# EAGLE design sapflow_pcb_v1 (EAGLE 9.1.3)
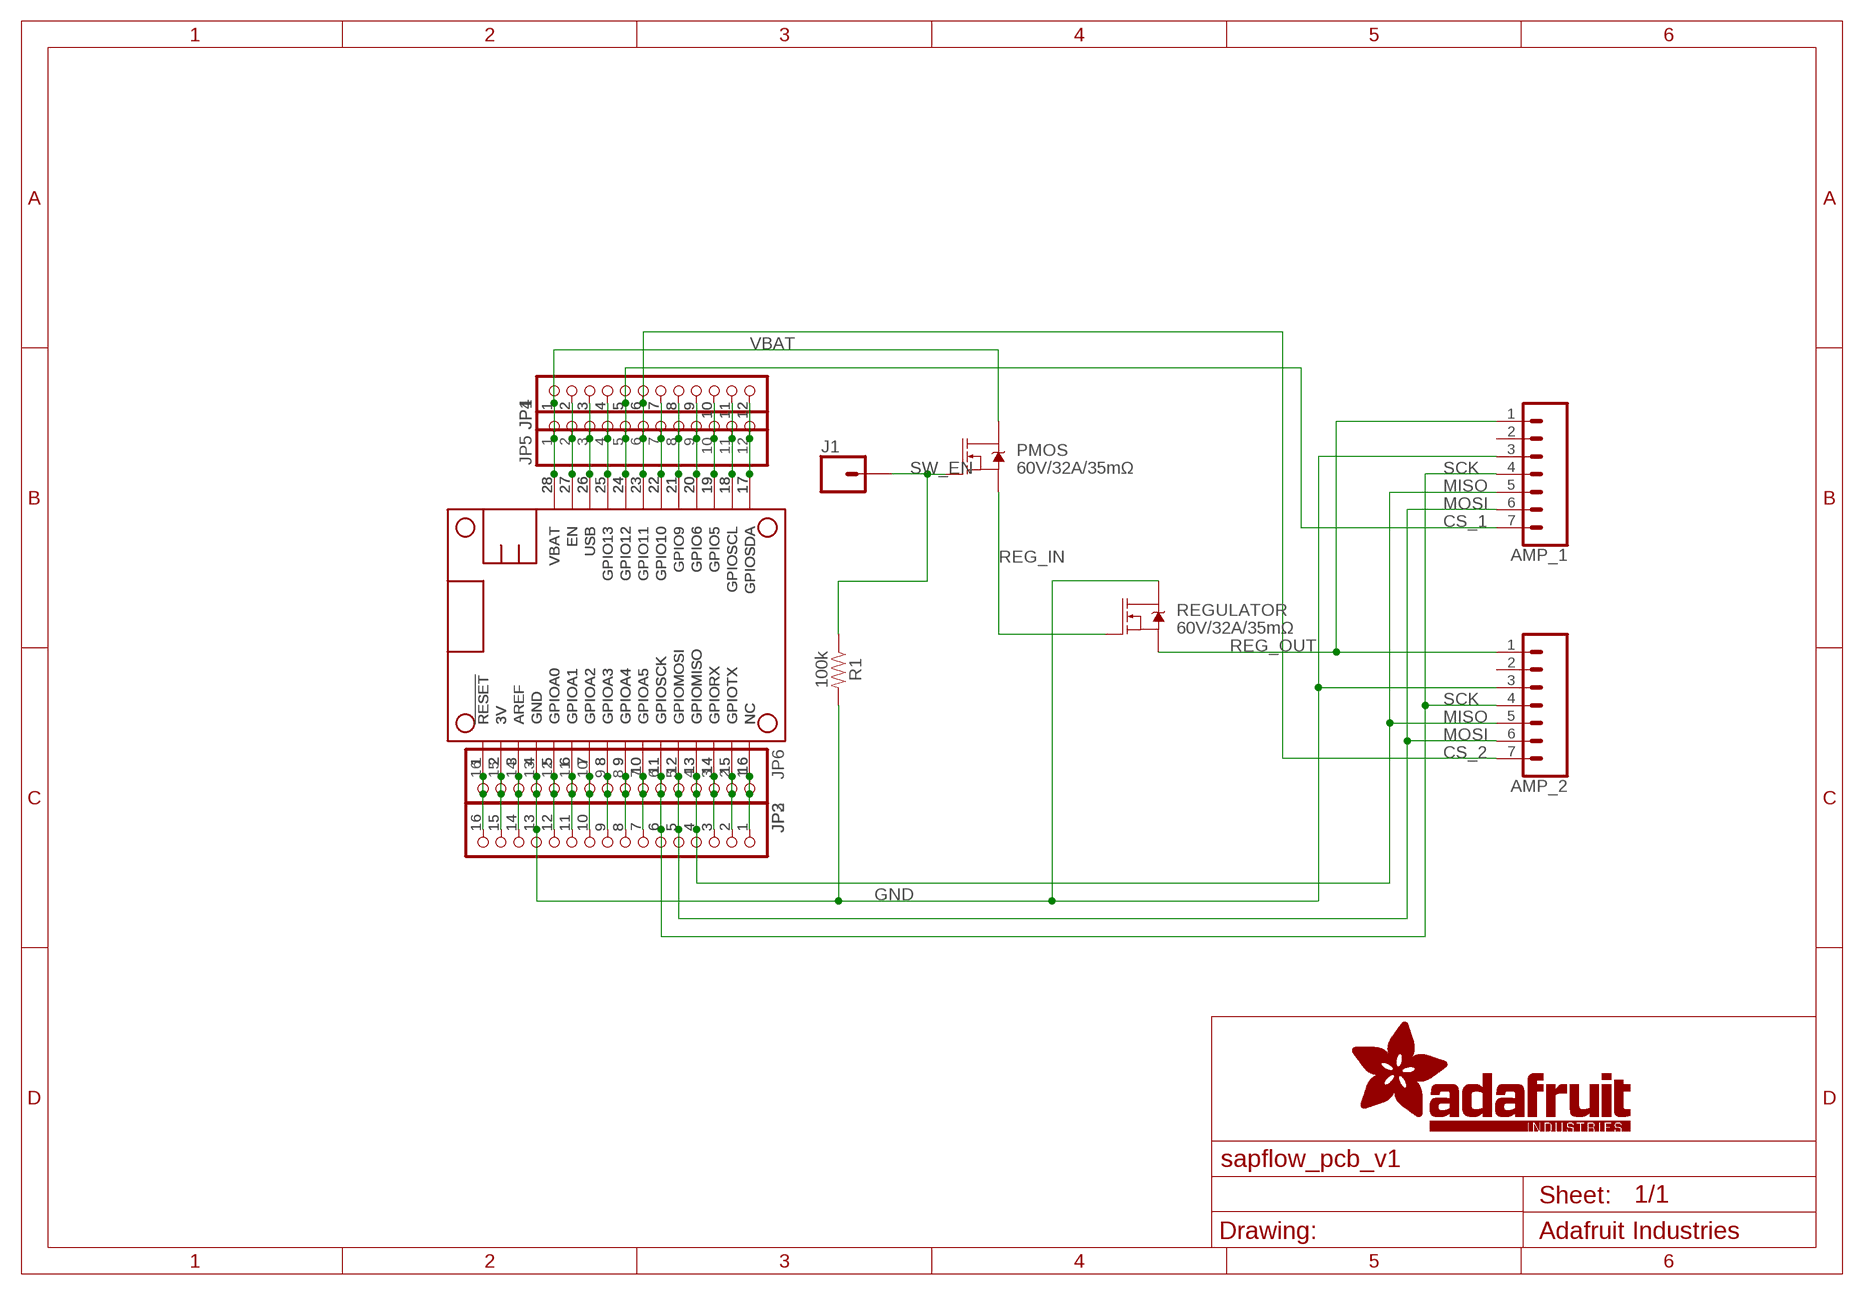
[diagram p0: schematic, sheet 1]

## Parts
AMP_1  CONN_07  [1X07]
AMP_2  CONN_07  [1X07]
J1  CONN_01  [1X01]
JP1  HEADER-1X1276MIL  [1X12_ROUND_76MIL]
JP2  HEADER-1X16_76MIL  [1X16_ROUND_76MIL]
JP3  HEADER-1X16_76MIL  [1X16_ROUND_76MIL]
JP4  HEADER-1X1276MIL  [1X12_ROUND_76MIL]
JP5  HEADER-1X1276MIL  [1X12_ROUND_76MIL]
JP6  HEADER-1X16_76MIL  [1X16_ROUND_76MIL]
MS1  FEATHERWING_NODIM  [FEATHERWING_DIM]
MS2  FEATHERWING_NODIM  [FEATHERWING_DIM]
MS3  FEATHERWING_NODIM  [FEATHERWING_DIM]
PMOS  60V/32A/35mΩ  MOSFET-NCH-FQP30N06L  [TO220V]
R1  100k  100KOHM-HORIZ-1/4W-1%  [AXIAL-0.3]
REGULATOR  60V/32A/35mΩ  MOSFET-NCH-FQP30N06L  [TO220V]

## Nets
3V: JP2.15 JP3.15 JP6.15 MS1.2(3V) MS2.2(3V) MS3.2(3V)
A: JP2.12 JP3.12 JP6.12 MS1.5(GPIOA0) MS2.5(GPIOA0) MS3.5(GPIOA0)
AREF: JP2.14 JP3.14 JP6.14 MS1.3(AREF) MS2.3(AREF) MS3.3(AREF)
B: JP2.11 JP3.11 JP6.11 MS1.6(GPIOA1) MS2.6(GPIOA1) MS3.6(GPIOA1)
C: JP2.10 JP3.10 JP6.10 MS1.7(GPIOA2) MS2.7(GPIOA2) MS3.7(GPIOA2)
CS_1: AMP_1.7 JP1.5 JP4.5 JP5.5 MS1.24(GPIO12) MS2.24(GPIO12) MS3.24(GPIO12)
CS_2: AMP_2.7 JP1.6 JP4.6 JP5.6 MS1.23(GPIO11) MS2.23(GPIO11) MS3.23(GPIO11)
D: JP2.9 JP3.9 JP6.9 MS1.8(GPIOA3) MS2.8(GPIOA3) MS3.8(GPIOA3)
E: JP2.8 JP3.8 JP6.8 MS1.9(GPIOA4) MS2.9(GPIOA4) MS3.9(GPIOA4)
EN: JP1.2 JP4.2 JP5.2 MS1.27(EN) MS2.27(EN) MS3.27(EN)
F: JP2.7 JP3.7 JP6.7 MS1.10(GPIOA5) MS2.10(GPIOA5) MS3.10(GPIOA5)
G: JP2.1 JP3.1 JP6.1 MS1.16(NC) MS2.16(NC) MS3.16(NC)
GND: AMP_1.3 AMP_2.3 JP2.13 JP3.13 JP6.13 MS1.4(GND) MS2.4(GND) MS3.4(GND) R1.P$2 REGULATOR.2(D)
I: JP1.9 JP4.9 JP5.9 MS1.20(GPIO6) MS2.20(GPIO6) MS3.20(GPIO6)
J: JP1.10 JP4.10 JP5.10 MS1.19(GPIO5) MS2.19(GPIO5) MS3.19(GPIO5)
K: JP1.8 JP4.8 JP5.8 MS1.21(GPIO9) MS2.21(GPIO9) MS3.21(GPIO9)
L: JP1.7 JP4.7 JP5.7 MS1.22(GPIO10) MS2.22(GPIO10) MS3.22(GPIO10)
MISO: AMP_1.5 AMP_2.5 JP2.4 JP3.4 JP6.4 MS1.13(GPIOMISO) MS2.13(GPIOMISO) MS3.13(GPIOMISO)
MOSI: AMP_1.6 AMP_2.6 JP2.5 JP3.5 JP6.5 MS1.12(GPIOMOSI) MS2.12(GPIOMOSI) MS3.12(GPIOMOSI)
O: JP1.4 JP4.4 JP5.4 MS1.25(GPIO13) MS2.25(GPIO13) MS3.25(GPIO13)
REG_IN: PMOS.3(S) REGULATOR.1(G)
REG_OUT: AMP_1.1 AMP_2.1 REGULATOR.3(S)
RESET: JP2.16 JP3.16 JP6.16 MS1.1(!RESET) MS2.1(!RESET) MS3.1(!RESET)
RX: JP2.3 JP3.3 JP6.3 MS1.14(GPIORX) MS2.14(GPIORX) MS3.14(GPIORX)
SCK: AMP_1.4 AMP_2.4 JP2.6 JP3.6 JP6.6 MS1.11(GPIOSCK) MS2.11(GPIOSCK) MS3.11(GPIOSCK)
SCL: JP1.11 JP4.11 JP5.11 MS1.18(GPIOSCL) MS2.18(GPIOSCL) MS3.18(GPIOSCL)
SDA: JP1.12 JP4.12 JP5.12 MS1.17(GPIOSDA) MS2.17(GPIOSDA) MS3.17(GPIOSDA)
SW_EN: J1.1 PMOS.1(G) R1.P$1
TX: JP2.2 JP3.2 JP6.2 MS1.15(GPIOTX) MS2.15(GPIOTX) MS3.15(GPIOTX)
USB: JP1.3 JP4.3 JP5.3 MS1.26(USB) MS2.26(USB) MS3.26(USB)
VBAT: JP1.1 JP4.1 JP5.1 MS1.28(VBAT) MS2.28(VBAT) MS3.28(VBAT) PMOS.2(D)
Unconnected: AMP_1.2 AMP_2.2

## Library data of the parts
AMP_1 AMP_2 = SparkFun-Connectors:CONN_07: Multi connection point. Often used as Generic Header-pin footprint for 0.1 inch spaced/style header connections On any of the 0.1 inch spaced packages, you can populate with these: Break Away Headers - Straight <https://www.sparkfun.com/products/116> (PRT-00116) Break Away Male Headers - Right Angle <https://www.sparkfun.com/products/553> (PRT-00553) Female Headers <https://www.sparkfun.com/products/115> (PRT-00115) Break Away Headers - Machine Pin <https://www.sparkfun.com/products/117> (PRT-00117) Break Away Female Headers - Swiss Machine Pin <https://www.sparkfun.com/products/743> (PRT-00743) For SCREWTERMINALS and SPRING TERMINALS visit here: Screw Terimnals on SparkFun.com <https://www.sparkfun.com/search/results?term=Screw+Terminals> (5mm/3.5mm/2.54mm spacing) This device is also useful as a general connection point to wire up your design to another part of your project. Our various solder wires solder well into these plated through hole pads. Hook-Up Wire - Assortment (Stranded, 22 AWG) <https://www.sparkfun.com/products/11375> (PRT-11375) Hook-Up Wire - Assortment (Solid Core, 22 AWG) <https://www.sparkfun.com/products/11367> (PRT-11367) View the entire wire category on our website here <https://www.sparkfun.com/categories/141> Special notes: Molex polarized connector foot print use with SKU : PRT-08231 with associated crimp pins and housings. 1MM SMD Version SKU: PRT-10208 NOTES ON THE VARIANTS LOCK and LOCK_LONGPADS... This footprint was designed to help hold the alignment of a through-hole component (i.e. 6-pin header) while soldering it into place. You may notice that each hole has been shifted either up or down by 0.005 of an inch from it's more standard position (which is a perfectly straight line). This slight alteration caused the pins (the squares in the middle) to touch the edges of the holes. Because they are alternating, it causes a "brace" to hold the component in place. 0.005 has proven to be the perfect amount of "off-center" position when using our standard breakaway headers. Although looks a little odd when you look at the bare footprint, once you have a header in there, the alteration is very hard to notice. Also,if you push a header all the way into place, it is covered up entirely on the bottom side.
J1 = SparkFun-Connectors:CONN_01: Single connection point. Often used as Generic Header-pin footprint for 0.1 inch spaced/style header connections On any of the 0.1 inch spaced packages, you can populate with these: Break Away Headers - Straight <https://www.sparkfun.com/products/116> (PRT-00116) Break Away Male Headers - Right Angle <https://www.sparkfun.com/products/553> (PRT-00553) Female Headers <https://www.sparkfun.com/products/115> (PRT-00115) Break Away Headers - Machine Pin <https://www.sparkfun.com/products/117> (PRT-00117) Break Away Female Headers - Swiss Machine Pin <https://www.sparkfun.com/products/743> (PRT-00743) This device is also useful as a general connection point to wire up your design to another part of your project. Our various solder wires solder well into these plated through hole pads. Hook-Up Wire - Assortment (Stranded, 22 AWG) <https://www.sparkfun.com/products/11375> (PRT-11375) Hook-Up Wire - Assortment (Solid Core, 22 AWG) <https://www.sparkfun.com/products/11367> (PRT-11367) View the entire wire category on our website here <https://www.sparkfun.com/categories/141> Special notes: SMTSO-256-ET is a "flush mount" nut for a 4-40 screw. We mostly use this on specialty testbeds; it is a nice way to connect hardware to your PCB at an adjustable hieght. Also note, the SNAP packages are for using a snappable style connector. We sell a baggie of snaps and they are also used on two LilyPad designs: Snap Assortment - 30 pack (male and female) <https://www.sparkfun.com/products/11347> (DEV-11347) LilyPad Arduino SimpleSnap <https://www.sparkfun.com/products/10941> (DEV-10941) LilyPad SimpleSnap Protoboard <https://www.sparkfun.com/products/10940> (DEV-10940)
JP1 JP4 JP5 = microbuilder:HEADER-1X12
JP2 JP3 JP6 = microbuilder:HEADER-1X16: PIN HEADER
MS1-MS3 = microbuilder:FEATHERWING
PMOS REGULATOR = SparkFun-DiscreteSemi:MOSFET-NCH: N-channel MOSFETs Voltage controlled devices that allow control of high current outputs. SparkFun Products: SparkFun OpenScale <https://www.sparkfun.com/products/13261> SparkFun Digital Sandbox <https://www.sparkfun.com/products/12651> SparkFun Monster Moto Shield <https://www.sparkfun.com/products/10182> SparkFun MOSFET Power Controller <https://www.sparkfun.com/products/11214>; PROD_ID: TRANS-10060
R1 = SparkFun-Resistors:100KOHM: 100kΩ resistor A resistor is a passive two-terminal electrical component that implements electrical resistance as a circuit element. Resistors act to reduce current flow, and, at the same time, act to lower voltage levels within circuits. - Wikipedia; PROD_ID: RES-12184

## Board
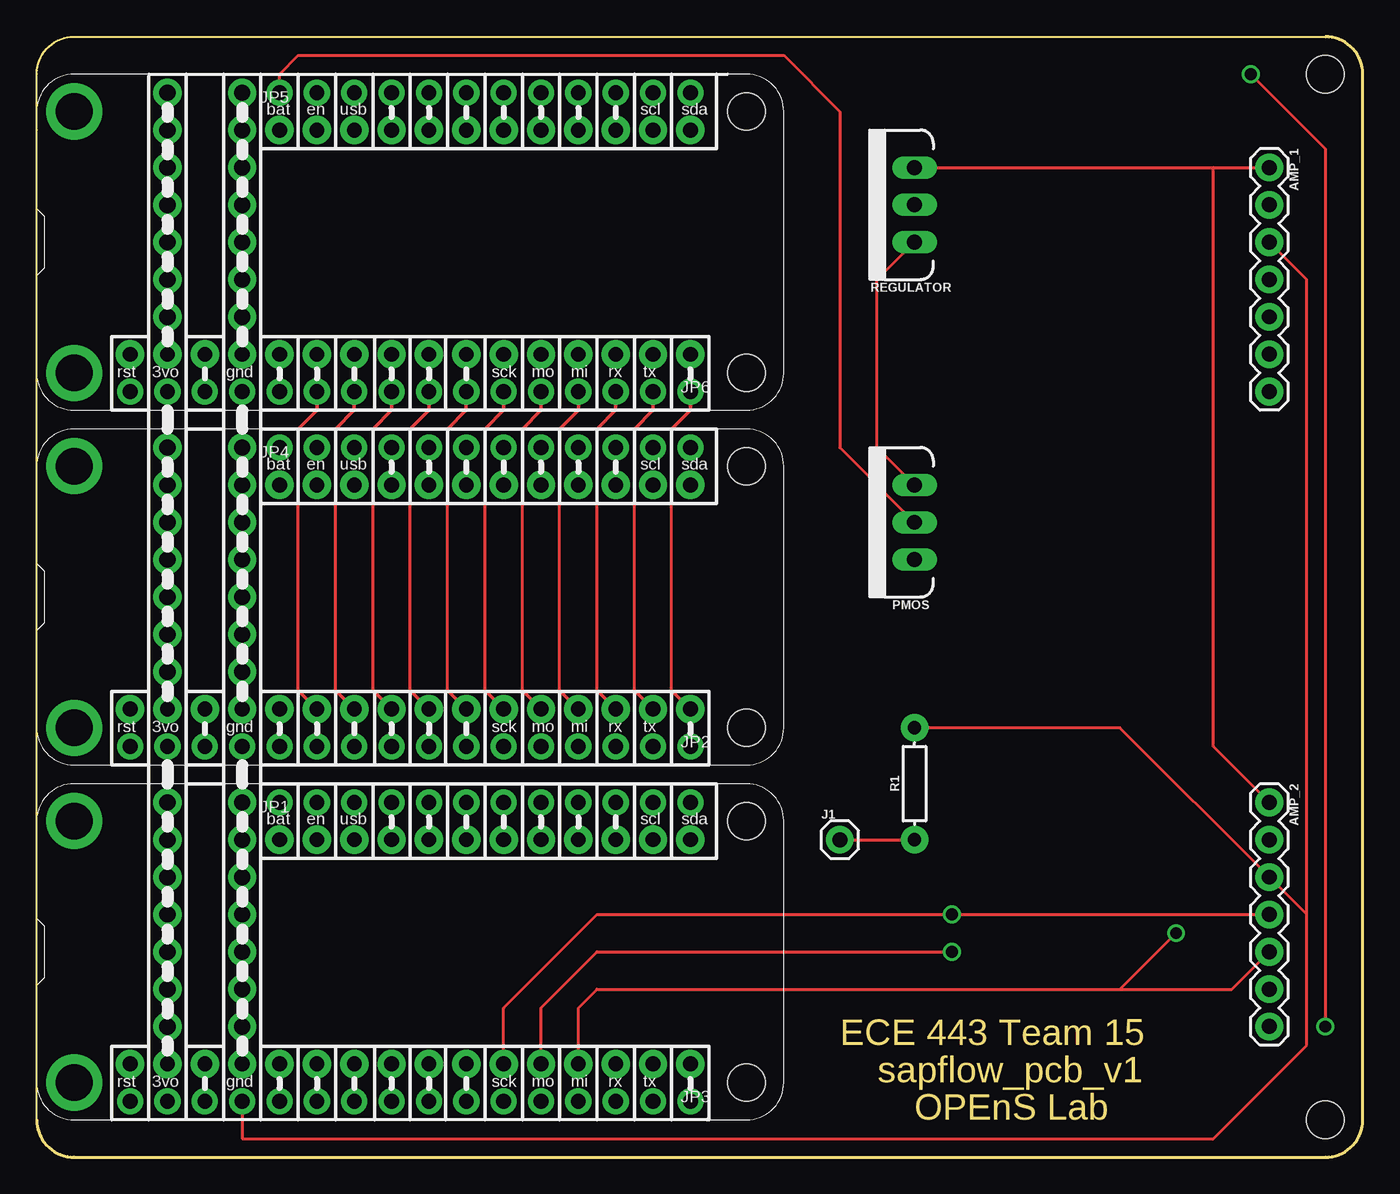
[diagram p1: board, top side]
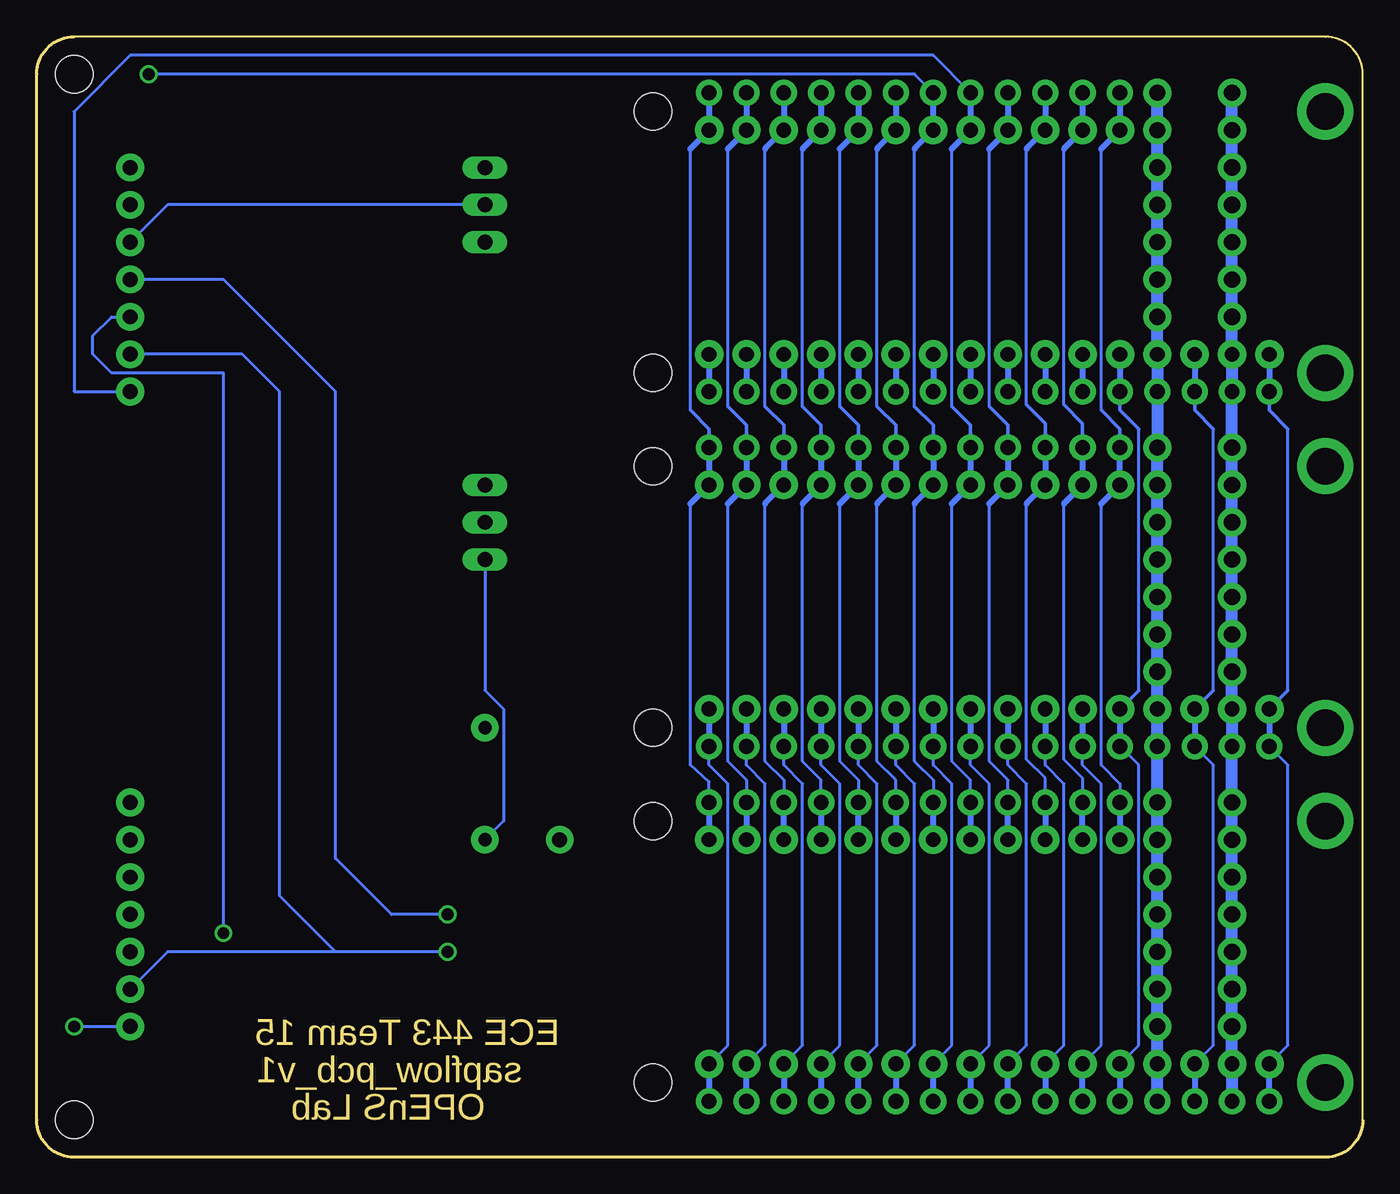
[diagram p2: board, bottom side, seen from below]

Size 90.17 x 76.2 mm. Coordinates in mm from the lower left corner, seen from the top.
Outline: 0,69.85 0,71.12
Outline: 0,69.85 0,73.66 arc-90 2.54,76.2 87.63,76.2 arc-90 90.17,73.66 90.17,2.54 arc-90 87.63,0 2.54,0 arc-90 0,2.54 0,69.85
Copper layers (1*16): Top 0.035mm / dielectric 1.5mm / Bottom 0.035mm
Design rules "adafruit": minimum track width 8mil, minimum drill 15.5mil, track to track 8mil, track to pad 8mil, pad to pad 8mil, via to via 8mil, smd to smd 8mil, copper to edge 10mil, drill to drill 8mil, minimum pad ring 10mil, minimum via ring 8mil, stop-mask expansion 2mil, vias tented up to drill 20mil, thermal gap 10mil
Holes 2.54 mm at 87.63,2.54 87.63,73.66

### Footprints (pad centres in the part's own frame; a part is rotated, then mirrored left to right if it is on the bottom)
1X07 = drill 1.016 pad 1.88: 1 0,0; 2 2.54,0; 3 5.08,0; 4 7.62,0; 5 10.16,0; 6 12.7,0; 7 15.24,0
1X01 = drill 1.016 pad 1.88: 1 0,0
1X12_ROUND_76MIL = drill 1 pad 1.93: 1 -13.97,0; 2 -11.43,0; 3 -8.89,0; 4 -6.35,0; 5 -3.81,0; 6 -1.27,0; 7 1.27,0; 8 3.81,0; 9 6.35,0; 10 8.89,0; 11 11.43,0; 12 13.97,0
1X16_ROUND_76MIL = drill 1 pad 1.93: 1 -19.05,0; 2 -16.51,0; 3 -13.97,0; 4 -11.43,0; 5 -8.89,0; 6 -6.35,0; 7 -3.81,0; 8 -1.27,0; 9 1.27,0; 10 3.81,0; 11 6.35,0; 12 8.89,0; 13 11.43,0; 14 13.97,0; 15 16.51,0; 16 19.05,0
FEATHERWING_DIM = drill 1 pad 1.778: 1 6.35,1.27; 2 8.89,1.27; 3 11.43,1.27; 4 13.97,1.27; 5 16.51,1.27; 6 19.05,1.27; 7 21.59,1.27; 8 24.13,1.27; 9 26.67,1.27; 10 29.21,1.27; 11 31.75,1.27; 12 34.29,1.27; 13 36.83,1.27; 14 39.37,1.27; 15 41.91,1.27; 16 44.45,1.27; 17 44.45,21.59; 18 41.91,21.59; 19 39.37,21.59; 20 36.83,21.59; 21 34.29,21.59; 22 31.75,21.59; 23 29.21,21.59; 24 26.67,21.59; 25 24.13,21.59; 26 21.59,21.59; 27 19.05,21.59; 28 16.51,21.59 | drill 2.5 pad 3.81: P$1 2.54,20.32; P$2 2.54,2.54 | hole 2.54: 48.26,20.32; 48.26,2.54
TO220V = drill 1.016 long: 1 -2.54,0; 2 0,0; 3 2.54,0
AXIAL-0.3 = drill 0.9 pad 1.88: P$1 -3.81,0; P$2 3.81,0

### Placement (x,y rotation side)
AMP_1  83.82,67.31 270 top
AMP_2  83.82,24.13 270 top
J1  54.61,21.59 0 top
JP1  30.48,21.59 0 top
JP2  25.4,30.48 180 top
JP3  25.4,6.35 180 top
JP4  30.48,45.72 0 top
JP5  30.48,69.85 0 top
JP6  25.4,54.61 180 top
MS1  0,2.54 0 top
MS2  0,26.67 0 top
MS3  0,50.8 0 top
PMOS  59.69,43.18 90 top
R1  59.69,25.4 90 top
REGULATOR  59.69,64.77 90 top

### Tracks (layer width: path | path; a pad name or v marks a point on that pad's centre or on a via)
3V  (via drill 1.1 pad 1.93)
  Bottom 0.813: MS1.2 JP3.15 v8.89,8.89 v8.89,11.43 v8.89,13.97 v8.89,16.51 v8.89,19.05 v8.89,21.59 v8.89,24.13 MS2.2 JP2.15 v8.89,33.02 v8.89,35.56 v8.89,38.1 v8.89,40.64 v8.89,43.18 v8.89,45.72 v8.89,48.26 MS3.2 JP6.15 v8.89,57.15 v8.89,59.69 v8.89,62.23 v8.89,64.77 v8.89,67.31 v8.89,69.85 v8.89,72.39
A
  Bottom 0.203: JP3.12 15.24,7.62 15.24,26.67 MS2.5 | 15.24,31.75 15.24,49.53
  Bottom 0.254: JP2.12 15.24,31.75 | 15.24,49.53 16.51,50.8 MS3.5
  Bottom 0.406: JP3.12 MS1.5 | JP2.12 MS2.5 | JP6.12 MS3.5
AREF
  Bottom 0.203: JP3.14 10.16,7.62 10.16,26.67 MS2.3 | 10.16,31.75 10.16,49.53
  Bottom 0.254: JP2.14 10.16,31.75 | 10.16,49.53 11.43,50.8 MS3.3
  Bottom 0.406: JP3.14 MS1.3 | JP2.14 MS2.3 | JP6.14 MS3.3
B
  Top 0.203: 17.78,31.75 17.78,49.53
  Top 0.254: JP2.11 17.78,31.75 | 17.78,49.53 19.05,50.8 MS3.6
  Bottom 0.203: JP3.11 17.78,7.62 17.78,25.4 19.05,26.67 MS2.6
  Bottom 0.406: MS1.6 JP3.11 | JP2.11 MS2.6 | JP6.11 MS3.6
C
  Top 0.203: 20.32,31.75 20.32,49.53
  Top 0.254: JP2.10 20.32,31.75 | 20.32,49.53 21.59,50.8 MS3.7
  Bottom 0.203: JP3.10 20.32,7.62 20.32,25.4 21.59,26.67 MS2.7
  Bottom 0.406: JP3.10 MS1.7 | JP2.10 MS2.7 | JP6.10 MS3.7
CS_1
  Bottom 0.203: MS1.24 26.67,25.65 27.94,26.92 27.94,44.45 | 27.94,51.05 27.94,68.58 | MS3.24 29.21,74.93 83.82,74.93 87.63,71.12 87.63,52.07 AMP_1.7
  Bottom 0.254: 27.94,51.05 26.67,49.78 MS2.24
  Bottom 0.406: MS1.24 JP1.5 | MS2.24 JP4.5 27.94,44.45 | 27.94,68.58 JP5.5 MS3.24
CS_2  (via drill 0.8)
  Top 0.203: v82.55,73.66 87.63,68.58 v87.63,8.89
  Bottom 0.203: MS1.23 29.21,25.65 30.48,26.92 30.48,44.45 | 30.48,51.05 30.48,68.58 | MS3.23 30.48,73.66 v82.55,73.66 | v87.63,8.89 AMP_2.7
  Bottom 0.254: 30.48,51.05 29.21,49.78 MS2.23
  Bottom 0.406: JP1.6 MS1.23 | MS2.23 JP4.6 30.48,44.45 | 30.48,68.58 JP5.6 MS3.23
D
  Top 0.203: 22.86,31.75 22.86,49.53
  Top 0.254: JP2.9 22.86,31.75 | 22.86,49.53 24.13,50.8 MS3.8
  Bottom 0.203: JP3.9 22.86,7.62 22.86,25.4 24.13,26.67 MS2.8
  Bottom 0.406: MS1.8 JP3.9 | JP2.9 MS2.8 | JP6.9 MS3.8
E
  Top 0.203: 25.4,31.75 25.4,49.53
  Top 0.254: JP2.8 25.4,31.75 | 25.4,49.53 26.67,50.8 MS3.9
  Bottom 0.203: JP3.8 25.4,7.62 25.4,25.4 26.67,26.67 MS2.9
  Bottom 0.406: JP3.8 MS1.9 | JP2.8 MS2.9 | JP6.8 MS3.9
EN
  Bottom 0.203: MS1.27 19.05,25.78 20.32,27.05 20.32,44.45 | 20.32,51.18 20.32,68.58
  Bottom 0.254: 20.32,51.18 19.05,49.91 MS2.27
  Bottom 0.406: JP1.2 MS1.27 | MS2.27 JP4.2 20.32,44.45 | 20.32,68.58 JP5.2 MS3.27
F
  Top 0.203: 27.94,31.75 27.94,49.53
  Top 0.254: JP2.7 27.94,31.75 | 27.94,49.53 29.21,50.8 MS3.10
  Bottom 0.203: JP3.7 27.94,7.62 27.94,25.4 29.21,26.67 MS2.10
  Bottom 0.406: MS1.10 JP3.7 | JP2.7 MS2.10 | JP6.7 MS3.10
G
  Top 0.203: 43.18,31.75 43.18,49.53
  Top 0.254: JP2.1 43.18,31.75 | 43.18,49.53 44.45,50.8 MS3.16
  Bottom 0.203: JP3.1 43.18,7.62 43.18,25.4 44.45,26.67 MS2.16
  Bottom 0.406: JP3.1 MS1.16 | JP2.1 MS2.16 | JP6.1 MS3.16
GND  (via drill 1.1 pad 1.93)
  Top 0.203: MS1.4 13.97,1.27 80.01,1.27 86.36,7.62 86.36,16.51 | 86.36,16.51 AMP_2.3 73.66,29.21 R1.P$2 | 86.36,16.51 86.36,59.69 AMP_1.3
  Bottom 0.203: REGULATOR.2 81.28,64.77 AMP_1.3
  Bottom 0.813: MS1.4 JP3.13 v13.97,8.89 v13.97,11.43 v13.97,13.97 v13.97,16.51 v13.97,19.05 v13.97,21.59 v13.97,24.13 MS2.4 JP2.13 v13.97,33.02 v13.97,35.56 v13.97,38.1 v13.97,40.64 v13.97,43.18 v13.97,45.72 v13.97,48.26 MS3.4 JP6.13 v13.97,57.15 v13.97,59.69 v13.97,62.23 v13.97,64.77 v13.97,67.31 v13.97,69.85 v13.97,72.39
I
  Bottom 0.203: MS1.20 36.83,25.65 38.1,26.92 38.1,44.45 | 38.1,51.05 38.1,68.58
  Bottom 0.254: 38.1,51.05 36.83,49.78 MS2.20
  Bottom 0.406: MS1.20 JP1.9 | MS2.20 JP4.9 38.1,44.45 | 38.1,68.58 JP5.9 MS3.20
J
  Bottom 0.203: 39.37,23.62 MS1.19 39.37,25.65 40.64,26.92 40.64,44.45 | 40.64,51.05 40.64,68.58
  Bottom 0.254: 40.64,51.05 39.37,49.78 MS2.19
  Bottom 0.406: JP1.10 39.37,23.62 | MS2.19 JP4.10 40.64,44.45 | 40.64,68.58 JP5.10 MS3.19
K
  Bottom 0.203: MS1.21 34.29,25.65 35.56,26.92 35.56,44.45 | 35.56,51.05 35.56,68.58
  Bottom 0.254: 35.56,51.05 34.29,49.78 MS2.21
  Bottom 0.406: JP1.8 MS1.21 | MS2.21 JP4.8 35.56,44.45 | 35.56,68.58 JP5.8 MS3.21
L
  Bottom 0.203: MS1.22 31.75,25.65 33.02,26.92 33.02,44.45 | 33.02,51.05 33.02,68.58
  Bottom 0.254: 33.02,51.05 31.75,49.78 MS2.22
  Bottom 0.406: MS1.22 JP1.7 | MS2.22 JP4.7 33.02,44.45 | 33.02,68.58 JP5.7 MS3.22
MISO  (via drill 0.8)
  Top 0.203: 35.56,31.75 35.56,49.53 | JP3.4 36.83,10.16 38.1,11.43 73.66,11.43 | AMP_2.5 81.28,11.43 73.66,11.43 | 73.66,11.43 v77.47,15.24
  Top 0.254: JP2.4 35.56,31.75 | 35.56,49.53 36.83,50.8 MS3.13
  Bottom 0.203: JP3.4 35.56,7.62 35.56,25.4 36.83,26.67 MS2.13 | AMP_1.5 85.09,57.15 86.36,55.88 86.36,54.61 85.09,53.34 77.47,53.34 v77.47,15.24
  Bottom 0.406: JP3.4 MS1.13 | JP2.4 MS2.13 | JP6.4 MS3.13
MOSI  (via drill 0.8)
  Top 0.203: 33.02,31.75 33.02,49.53 | JP3.5 34.29,10.16 38.1,13.97 v62.23,13.97
  Top 0.254: JP2.5 33.02,31.75 | 33.02,49.53 34.29,50.8 MS3.12
  Bottom 0.203: JP3.5 33.02,7.62 33.02,25.4 34.29,26.67 MS2.12 | AMP_2.6 81.28,13.97 v62.23,13.97 69.85,13.97 73.66,17.78 73.66,52.07 76.2,54.61 AMP_1.6
  Bottom 0.406: MS1.12 JP3.5 | JP2.5 MS2.12 | JP6.5 MS3.12
O
  Bottom 0.203: MS1.25 24.13,25.65 25.4,26.92 25.4,44.45 | 25.4,51.05 25.4,68.58
  Bottom 0.254: 25.4,51.05 24.13,49.78 MS2.25
  Bottom 0.406: JP1.4 MS1.25 | MS2.25 JP4.4 25.4,44.45 | 25.4,68.58 JP5.4 MS3.25
REG_IN
  Top 0.203: PMOS.3 57.15,48.26 57.15,59.69 REGULATOR.1
REG_OUT
  Top 0.203: REGULATOR.3 80.01,67.31 | 80.01,67.31 AMP_1.1 | AMP_2.1 80.01,27.94 80.01,67.31
RESET
  Bottom 0.203: JP3.16 5.08,7.62 5.08,26.67 MS2.1 | 5.08,31.75 5.08,49.53
  Bottom 0.254: JP2.16 5.08,31.75 | 5.08,49.53 6.35,50.8 MS3.1
  Bottom 0.406: MS1.1 JP3.16 | JP2.16 MS2.1 | JP6.16 MS3.1
RX
  Top 0.203: 38.1,31.75 38.1,49.53
  Top 0.254: JP2.3 38.1,31.75 | 38.1,49.53 39.37,50.8 MS3.14
  Bottom 0.203: JP3.3 38.1,7.62 38.1,25.4 39.37,26.67 MS2.14
  Bottom 0.406: JP3.3 MS1.14 | JP2.3 MS2.14 | JP6.3 MS3.14
SCK  (via drill 0.8)
  Top 0.203: 30.48,31.75 30.48,49.53 | JP3.6 31.75,10.16 38.1,16.51 v62.23,16.51 AMP_2.4
  Top 0.254: JP2.6 30.48,31.75 | 30.48,49.53 31.75,50.8 MS3.11
  Bottom 0.203: JP3.6 30.48,7.62 30.48,25.4 31.75,26.67 MS2.11 | v62.23,16.51 66.04,16.51 69.85,20.32 69.85,52.07 77.47,59.69 AMP_1.4
  Bottom 0.406: JP3.6 MS1.11 | JP2.6 MS2.11 | JP6.6 MS3.11
SCL
  Bottom 0.203: MS1.18 41.91,25.65 43.18,26.92 43.18,44.45 | 43.18,51.05 43.18,68.58
  Bottom 0.254: 43.18,51.05 41.91,49.78 MS2.18
  Bottom 0.406: MS1.18 JP1.11 | MS2.18 JP4.11 43.18,44.45 | 43.18,68.58 JP5.11 MS3.18
SDA
  Bottom 0.203: MS1.17 44.45,25.53 45.72,26.67 45.72,44.45 | 45.72,50.8 45.72,68.58
  Bottom 0.254: 45.72,50.8 44.45,49.53 MS2.17
  Bottom 0.406: MS1.17 JP1.12 | MS2.17 JP4.12 45.72,44.45 | 45.72,68.58 JP5.12 MS3.17
SW_EN
  Top 0.203: J1.1 R1.P$1
  Bottom 0.203: PMOS.1 59.69,31.75 58.42,30.48 58.42,22.86 R1.P$1
TX
  Top 0.203: 40.64,31.75 40.64,49.53
  Top 0.254: JP2.2 40.64,31.75 | 40.64,49.53 41.91,50.8 MS3.15
  Bottom 0.203: JP3.2 40.64,7.62 40.64,25.4 41.91,26.67 MS2.15
  Bottom 0.406: MS1.15 JP3.2 | JP2.2 MS2.15 | JP6.2 MS3.15
USB
  Bottom 0.203: MS1.26 21.59,25.78 22.86,27.05 22.86,44.45 | 22.86,51.18 22.86,68.58
  Bottom 0.254: 22.86,51.18 21.59,49.91 MS2.26
  Bottom 0.406: MS1.26 JP1.3 | MS2.26 JP4.3 22.86,44.45 | 22.86,68.58 JP5.3 MS3.26
VBAT
  Top 0.203: MS3.28 16.51,73.66 17.78,74.93 50.8,74.93 54.61,71.12 54.61,48.26 PMOS.2
  Bottom 0.203: MS1.28 16.51,25.4 17.78,26.67 17.78,44.45 | 17.78,50.8 17.78,68.58
  Bottom 0.254: 17.78,50.8 16.51,49.53 MS2.28
  Bottom 0.406: MS1.28 JP1.1 | MS2.28 JP4.1 17.78,44.45 | 17.78,68.58 JP5.1 MS3.28

### Text on the board
Dimension: ECE 443 Team 15 | sapflow_pcb_v1 | OPEnS Lab
tPlace: bat | en | usb | scl | sda | rst | 3vo | gnd | sck | mo | mi | rx | tx | bat | en | usb | scl | sda | rst | 3vo | gnd | sck | mo | mi | rx | tx | bat | en | usb | scl | sda | rst | 3vo | gnd | sck | mo | mi | rx | tx